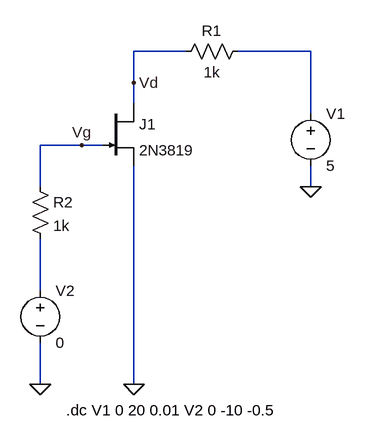
[diagram p0: schematic Output characteristics.asc]
Output characteristics.asc, the LTspice schematic file:
Version 4
SHEET 1 880 680
WIRE 304 48 224 48
WIRE 496 48 384 48
WIRE 224 96 224 48
WIRE 224 128 224 96
WIRE 496 144 496 48
WIRE 144 192 80 192
WIRE 176 192 144 192
WIRE 80 256 80 192
WIRE 496 256 496 224
WIRE 80 416 80 336
WIRE 80 560 80 496
WIRE 224 560 224 224
FLAG 80 560 0
FLAG 496 256 0
FLAG 224 560 0
FLAG 144 192 Vg
FLAG 224 96 Vd
SYMBOL njf 176 128 R0
SYMATTR InstName J1
SYMATTR Value 2N3819
SYMBOL res 400 32 R90
WINDOW 0 0 56 VBottom 2
WINDOW 3 32 56 VTop 2
SYMATTR InstName R1
SYMATTR Value 1k
SYMBOL res 64 240 R0
SYMATTR InstName R2
SYMATTR Value 1k
SYMBOL voltage 496 128 R0
WINDOW 123 0 0 Left 0
WINDOW 39 0 0 Left 0
SYMATTR InstName V1
SYMATTR Value 5
SYMBOL voltage 80 400 R0
WINDOW 123 0 0 Left 0
WINDOW 39 0 0 Left 0
SYMATTR InstName V2
SYMATTR Value 0
TEXT 120 600 Left 2 !.dc V1 0 20 0.01 V2 0 -10 -0.5

The netlist it stands for:
* Output characteristics.asc
J1 Vd Vg 0 2N3819
R1 N001 Vd 1k
R2 Vg N002 1k
V1 N001 0 5
V2 N002 0 0
.model NJF NJF
.model PJF PJF
.lib standard.jft
.dc V1 0 20 0.01 V2 0 -10 -0.5
.backanno
.end